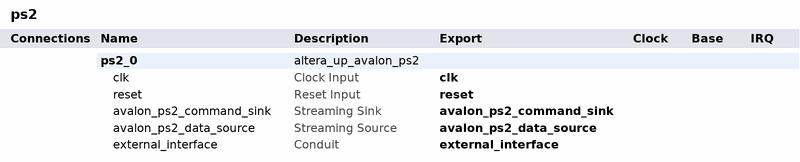
[diagram p0: system contents]
# Platform Designer (Qsys) system ps2, Cyclone IV E EP4CE6E22C8
# Parameters at their usual value, and those the tool derives, are not listed.
package require -exact qsys 18.0
create_system ps2
set_project_property DEVICE_FAMILY {Cyclone IV E}
set_project_property DEVICE EP4CE6E22C8

add_instance ps2_0 altera_up_avalon_ps2 18.0
set_instance_property ps2_0 AUTO_EXPORT true
set_instance_parameter_value ps2_0 avalon_bus_type Streaming

# exported interfaces
add_interface avalon_ps2_command_sink avalon_streaming sink
set_interface_property avalon_ps2_command_sink EXPORT_OF ps2_0.avalon_ps2_command_sink
add_interface avalon_ps2_data_source avalon_streaming source
set_interface_property avalon_ps2_data_source EXPORT_OF ps2_0.avalon_ps2_data_source
add_interface clk clock sink
set_interface_property clk EXPORT_OF ps2_0.clk
add_interface external_interface conduit end
set_interface_property external_interface EXPORT_OF ps2_0.external_interface
add_interface reset reset sink
set_interface_property reset EXPORT_OF ps2_0.reset

set_interconnect_requirement {$system} qsys_mm.clockCrossingAdapter HANDSHAKE
set_interconnect_requirement {$system} qsys_mm.enableEccProtection FALSE
set_interconnect_requirement {$system} qsys_mm.insertDefaultSlave FALSE
set_interconnect_requirement {$system} qsys_mm.maxAdditionalLatency 1

save_system ps2.qsys
